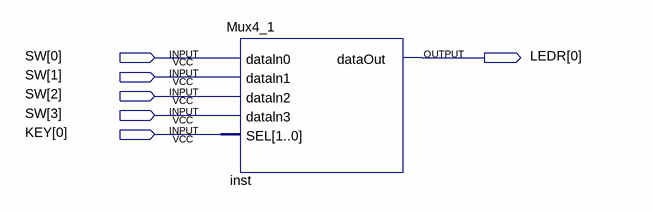
[diagram p0: schematic sheet]
// Quartus schematic Mux4_1Demo.bdf as structural Verilog: 1 symbols, 6 pins
module Mux4_1Demo (
  input  [3:0] SW,
  input  [0:0] KEY,
  output [0:0] LEDR
);

  Mux4_1 inst (
    .dataln0(SW[0]), .dataln1(SW[1]), .dataln2(SW[2]), .dataln3(SW[3]), .SEL({2{KEY[0]}}), .dataOut(LEDR[0]));
endmodule
